# Altium schematic sheet H_BRIDGE.SchDoc
size A4; SheetNumber: 4; SheetTotal: 4
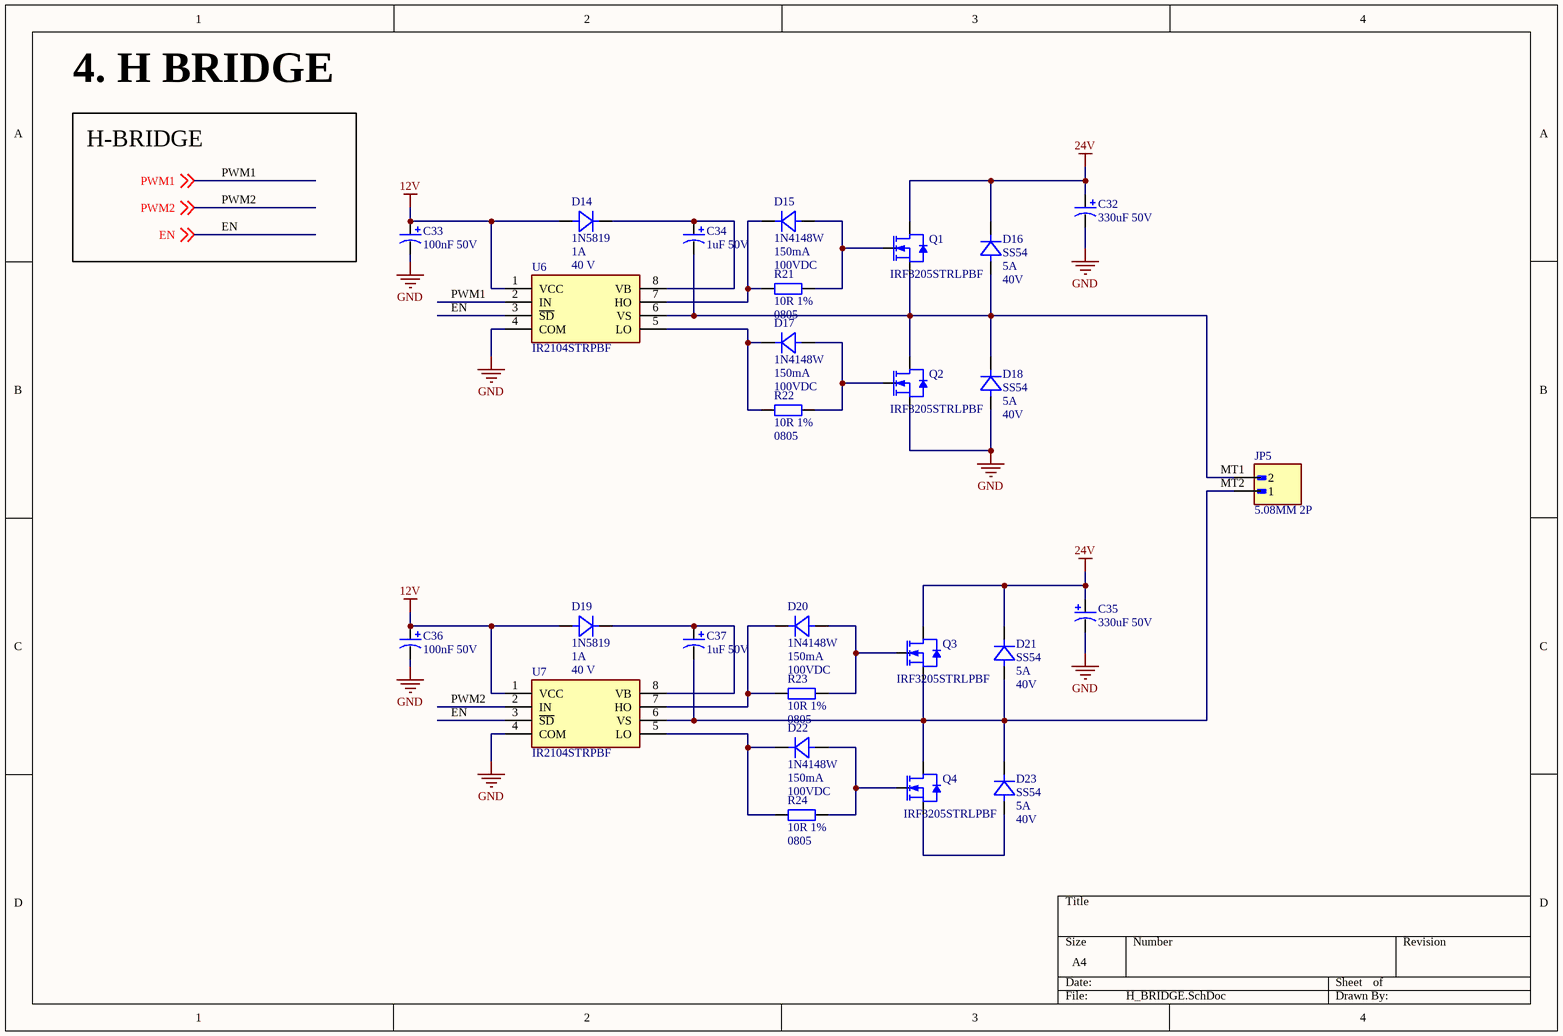
[diagram p0: H_BRIDGE.SchDoc]

## Parts
C32  330uF 50V  [CAP-ALU-SMD-G-NEW]
C33  100nF 50V  [CAP-ALU-SMD-B -NEW]
C34  1uF 50V  [CAP-ALU-SMD-B -NEW]
C35  330uF 50V  [CAP-ALU-SMD-G-NEW]
C36  100nF 50V  [CAP-ALU-SMD-B -NEW]
C37  1uF 50V  [CAP-ALU-SMD-B -NEW]
D14  1N5819  Current - Average Rectified (Io): 1A  Voltage - DC Reverse (Vr) (Max): 40 V  [DIO-SMD-123]
D15  1N4148W  Current: 150mA  DC Voltage: 100VDC  [DIO-SMD-123]
D16  SS54  Current: 5A  DC Voltage: 40V  [SMA]
D17  1N4148W  Current: 150mA  DC Voltage: 100VDC  [DIO-SMD-123]
D18  SS54  Current: 5A  DC Voltage: 40V  [SMA]
D19  1N5819  Current - Average Rectified (Io): 1A  Voltage - DC Reverse (Vr) (Max): 40 V  [DIO-SMD-123]
D20  1N4148W  Current: 150mA  DC Voltage: 100VDC  [DIO-SMD-123]
D21  SS54  Current: 5A  DC Voltage: 40V  [SMA]
D22  1N4148W  Current: 150mA  DC Voltage: 100VDC  [DIO-SMD-123]
D23  SS54  Current: 5A  DC Voltage: 40V  [SMA]
JP5  5.08MM 2P  [5.08MM 2P]
Q1  IRF3205STRLPBF  [TO263-3]
Q2  IRF3205STRLPBF  [TO263-3]
Q3  IRF3205STRLPBF  [TO263-3]
Q4  IRF3205STRLPBF  [TO263-3]
R21  10R 1%  Size: 0805  [RES_SMD_0805]
R22  10R 1%  Size: 0805  [RES_SMD_0805]
R23  10R 1%  Size: 0805  [RES_SMD_0805]
R24  10R 1%  Size: 0805  [RES_SMD_0805]
U6  IR2104STRPBF  [SOIC-8]
U7  IR2104STRPBF  [SOIC-8]

## Nets
12V: C33.1 C36.1 D14.A D19.A U6.1(VCC) U7.1(VCC)
24V: C32.1 C35.1 D16.C D21.C Q1.4(D) Q3.4(D)
GND: C32.2 C33.2 C35.2 C36.2 D18.A Q2.3(S) U6.4(COM) U7.4(COM)
EN: U6.3(~{SD}) U7.3(~{SD}) ; off-sheet EN
MT1: C34.2 D16.A D18.C JP5.2 Q1.3(S) Q2.4(D) U6.6(VS)
MT2: C37.2 D21.A D23.C JP5.1 Q3.3(S) Q4.4(D) U7.6(VS)
PWM1: U6.2(IN) ; off-sheet PWM1
PWM2: U7.2(IN) ; off-sheet PWM2
NetC34_1: C34.1 D14.C U6.8(VB)
NetC37_1: C37.1 D19.C U7.8(VB)
NetD15_A: D15.A Q1.1(G) R21.2
NetD15_C: D15.C R21.1 U6.7(HO)
NetD17_A: D17.A Q2.1(G) R22.2
NetD17_C: D17.C R22.1 U6.5(LO)
NetD20_A: D20.A Q3.1(G) R23.2
NetD20_C: D20.C R23.1 U7.7(HO)
NetD22_A: D22.A Q4.1(G) R24.2
NetD22_C: D22.C R24.1 U7.5(LO)
NetD23_A: D23.A Q4.3(S)

## Notes on the sheet
- 4. H BRIDGE
- H-BRIDGE

## Library data of the parts
C32 C35 = C_ALU_330uF_50V_G: 330uF 50V 170mA@120Hz ±20% SMD,D10xL10.2mm Aluminum Electrolytic Capacitors - SMD ROHS; Manufacturer: KNSCHA; Manufacture Part Number: RVT330UF50V167RV085; Packaging: Cut Tape (CT); Link: https://jlcpcb.com/partdetail/KNSCHA-RVT330UF50V167RV085/C5155333; Price: $0.0941
C33 C36 = C_ALU_100nF_50V_B: 100nF 50V ±20% SMD,D4xL5.4mm Aluminum Electrolytic Capacitors - SMD ROHS; Manufacturer: Changzhou Huawei Elec; Manufacture Part Number: VT1H0R1MB054000CE0; Packaging: Cut Tape; Link: https://www.lcsc.com/product-detail/Aluminum-Electrolytic-Capacitors-SMD_Changzhou-Huawei-Elec-VT1H0R1MB054000CE0_C271438.html; Price: $ 0.0342
C34 C37 = C_ALU_1uF_50V_B: 1uF 50V 7mA@120Hz ±20% SMD,D4xL5.4mm Aluminum Electrolytic Capacitors - SMD ROHS; Manufacturer: KNSCHA; Manufacture Part Number: RST1UF50V017; Packaging: Cut Tape; Link: https://www.lcsc.com/product-detail/Aluminum-Electrolytic-Capacitors-SMD_KNSCHA-RST1UF50V017_C4747972.html; Price: $ 0.0209
D14 D19 = 1N5819: Diode 40 V 1A Surface Mount SOD-123; Manufacturer: Diodes Incorporated; Manufacture Part Number: 1N5819HW-7-F; Voltage - Forward (Vf) (Max) @ If: 450 mV @ 1 A; Capacitance @ Vr, F: 60pF @ 4V, 1MHz; Packaging: Cut Tape (CT); Link: https://www.digikey.cn/en/products/detail/diodes-incorporated/1N5819HW-7-F/814970; Price: $0.43; Operating Temperature - Junction: -65°C ~ 125°C
D15 D17 D20 D22 = 1N4148W-TP: Diode 100 V 150mA Surface Mount SOD-123; Manufacturer: Micro Commercial Co; Manufacture Part Number: 1N4148W-TP; Packaging: Cut Tape (CT); Link: https://www.digikey.cn/en/products/detail/micro-commercial-co/1N4148W-TP/717196; Price: $0.12
D16 D18 D21 D23 = SS54: DIODE SCHOTTKY 40V 5A SMA; Manufacturer: EVVO; Manufacture Part Number: SS54; Packaging: Cut Tape (CT); Link: https://www.digikey.cn/en/products/detail/evvo/SS54/21407219; Price: $0.73
JP5 = TERMINAL_5.08MM_2P: 2 Position Terminal Block Header, Male Pins, Shrouded (2 Side) 0.200" (5.08mm) 90°, Right Angle Through Hole; Manufacturer: Phoenix Contact; Manufacture Part Number: 1759017; Packaging: Bulk; Link: https://www.digikey.cn/en/products/detail/phoenix-contact/1759017/260463?s=N4IgTCBcDaIIwHYCsBOADIkBdAvkA; Price: $0.58
Q1-Q4 = IRF3205STRLPBF: N-Channel 55 V 110A (Tc) 200W (Tc) Surface Mount D2PAK; Manufacturer: Infineon Technologies; Drain to Source Voltage (Vdss): 55 V; Drive Voltage (Max Rds On, Min Rds On): 10V; Vgs (Max): ±20V; Manufacture Part Number: IRF3205STRLPBF; Packaging: Cut Tape (CT); Link: https://www.digikey.cn/en/products/detail/infineon-technologies/IRF3205STRLPBF/856540; Price: $1.73; FET Type: N-Channel; Current - Continuous Drain (Id) @ 25°C: 110A (Tc); Power Dissipation (Max): 200W (Tc); Operating Temperature: -55°C ~ 175°C (TJ)
R21-R24 = R0805_10R: 10 Ohms ±1% 0.125W, 1/8W Chip Resistor 0805 (2012 Metric) Moisture Resistant Thick Film; Manufacturer: YAGEO; Manufacture Part Number: RC0805FR-0710RL; Packaging: Cut Tape (CT); Link: https://www.digikey.com/en/products/detail/yageo/RC0805FR-0710RL/727534; Price: $0.10
U6 U7 = IR2104STRPBF: Half Bridge 2 210mA 100ns 50ns 10V~20V 360mA SOIC-8 Gate Drivers ROHS; Manufacturer: Infineon Technologies; Manufacture Part Number: IR2104STRPBF; Packaging: Cut Tape (CT); Link: https://www.lcsc.com/product-detail/Gate-Drivers_Infineon-Technologies-IR2104STRPBF_C2960.html; Price: $ 0.51; Peak Output Current(source): 210mA; Rise Time: 100ns; Fall Time: 50ns; Supply Voltage: 10V~20V; Peak Output Current(sink): 360mA